# Altium schematic sheet 02-WIFT+BT.SchDoc: 手持设备通讯板
size A4; Address1: 张三; Address2: 441521200506202339; Address3: 15812345678; SheetNumber: 7; SheetTotal: 7
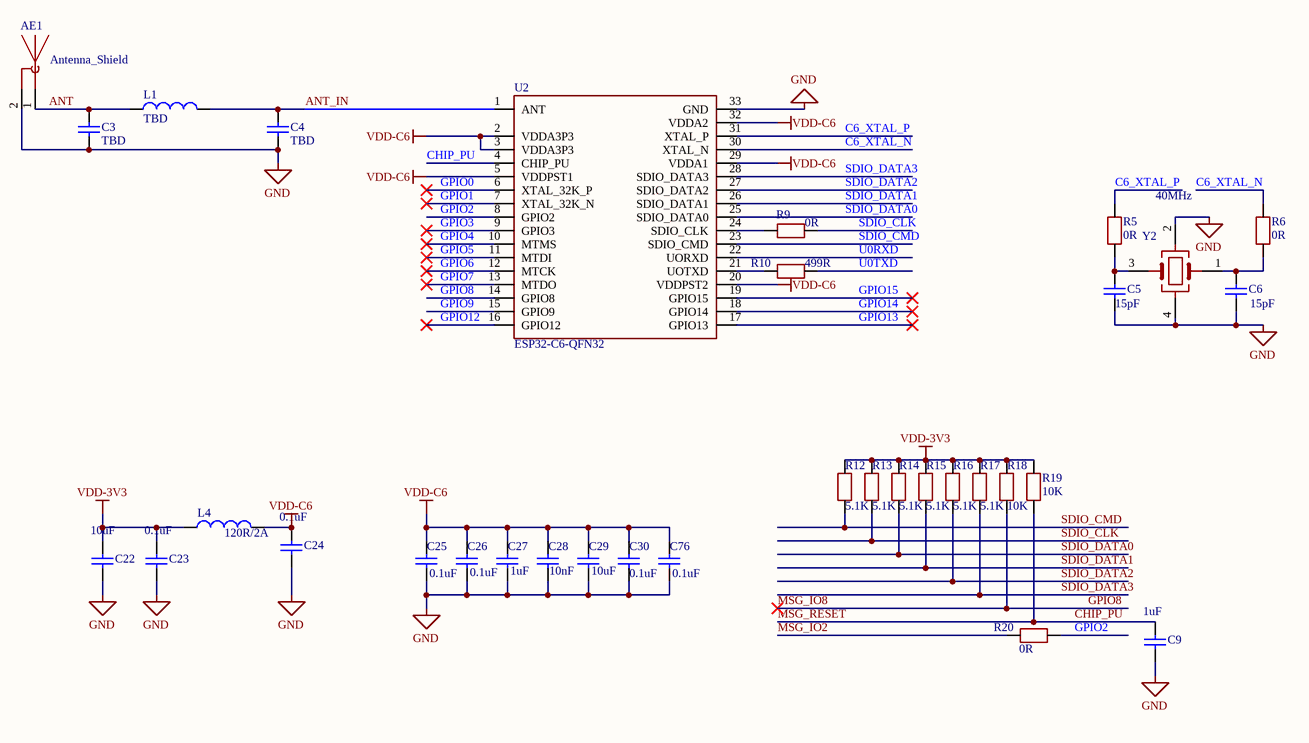
[diagram p0: 02-WIFT+BT.SchDoc]

## Parts
AE1  Antenna_Shield  [ANT]
C3  TBD  [C0402]
C4  TBD  [C0402]
C5  15pF  [C0402]
C6  15pF  [C0402]
C9  1uF  [C0402]
C22  10uF  [C0805]
C23  0.1uF  [C0402]
C24  0.1uF  [C0402]
C25  0.1uF  [C0402]
C26  0.1uF  [C0402]
C27  1uF  [C0402]
C28  10nF  [C0402]
C29  10uF  [C0805]
C30  0.1uF  [C0402]
C76  0.1uF  [C0402]
L1  TBD  [L0603]
L4  value 120R/2A  [L0603]  (hidden comment: Inductor)
R5  0R  [R0402]
R6  0R  [R0402]
R9  0R  [R0402]
R10  499R  [R0402]
R12  5.1K  [R0402]
R13  5.1K  [R0402]
R14  5.1K  [R0402]
R15  5.1K  [R0402]
R16  5.1K  [R0402]
R17  5.1K  [R0402]
R18  10K  [R0402]
R19  10K  [R0402]
R20  0R  [R0402]
U2  ESP32-C6-QFN32  [QFN-32_L5.0-W5.0-P0.50-TL-EP3.7]
Y2  40MHz  [OSC-SMD_4P-L3.2-W2.5-BL_SIT8008BI]

## Nets
GND: AE1.2 C3.1 C4.1 C5.2 C6.2 C9.1 C22.1 C23.1 C24.2 C25.2 C26.2 C27.2 C28.2 C29.2 C30.1 C76.2 U2.33(GND) Y2.2 Y2.4
VDD-3V3: C22.2 C23.2 L4.1 R12.1 R13.1 R14.1 R15.1 R16.1 R17.1 R18.1 R19.1
VDD-C6: C24.1 C25.1 C26.1 C27.1 C28.1 C29.1 C30.2 C76.1 L4.2 U2.2(VDDA3P3) U2.3(VDDA3P3) U2.5(VDDPST1) U2.20(VDDPST2) U2.29(VDDA1) U2.32(VDDA2)
ANT: AE1.1 C3.2 L1.1
ANT_IN: C4.2 L1.2 U2.1(ANT)
C6_XTAL_N: R6.2 U2.30(XTAL_N)
C6_XTAL_P: R5.2 U2.31(XTAL_P)
CHIP_PU: C9.2 R19.2 U2.4(CHIP_PU)  [also labelled MSG_RESET]
GPIO0: U2.6(XTAL_32K_P)
GPIO1: U2.7(XTAL_32K_N)
GPIO2: R20.2 U2.8(GPIO2)
GPIO3: U2.9(GPIO3)
GPIO4: U2.10(MTMS)
GPIO5: U2.11(MTDI)
GPIO6: U2.12(MTCK)
GPIO7: U2.13(MTDO)
GPIO8: R18.2 U2.14(GPIO8)  [also labelled MSG_IO8]
GPIO9: U2.15(GPIO9)
GPIO12: U2.16(GPIO12)
GPIO13: U2.17(GPIO13)
GPIO14: U2.18(GPIO14)
GPIO15: U2.19(GPIO15)
MSG_IO2: R20.1
SDIO_CLK: R9.2 R13.2
SDIO_CMD: R12.2 U2.23(SDIO_CMD)
SDIO_DATA0: R14.2 U2.25(SDIO_DATA0)
SDIO_DATA1: R15.2 U2.26(SDIO_DATA1)
SDIO_DATA2: R16.2 U2.27(SDIO_DATA2)
SDIO_DATA3: R17.2 U2.28(SDIO_DATA3)
U0RXD: U2.22(UORXD)
U0TXD: R10.2
NetC5_1: C5.1 R5.1 Y2.3
NetC6_1: C6.1 R6.1 Y2.1
NetR9_1: R9.1 U2.24(SDIO_CLK)
NetR10_1: R10.1 U2.21(UOTXD)

## Notes on the sheet
- 选手信息
- 图页名称
- 当前日期
- 当前时间
- 项目名称
- 第          幅
- 共          幅

## Library data of the parts
AE1 = Component_1
C3-C6 C9 C22-C30 C76 = Capacitor: SimulationGenericComponent: True
  C3 C4: Value: TBD
  C5 C6: Value: 15pF
  C9 C27: Value: 1uF
  C22 C29: Value: 10uF
  C23-C26 C30 C76: Value: 0.1uF
  C28: Value: 10nF
L1 L4 = Inductor: SimulationGenericComponent: True
  L1: Value: TBD
R5 R6 R9 R10 R12-R20 = R
Y2 = Component_3